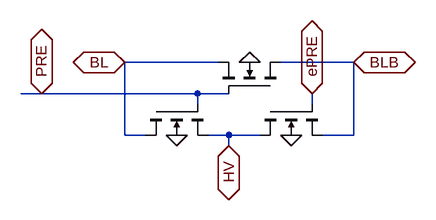
[diagram p0: schematic equalizer.asc]
equalizer.asc, the LTspice schematic file:
Version 4
SHEET 1 880 680
WIRE 192 96 48 96
WIRE 400 96 288 96
WIRE -80 144 -112 144
WIRE 160 144 -80 144
WIRE 208 144 160 144
WIRE 160 160 160 144
WIRE 336 160 336 144
WIRE 48 208 48 96
WIRE 80 208 48 208
WIRE 208 208 176 208
WIRE 256 208 208 208
WIRE 400 208 400 96
WIRE 400 208 352 208
WIRE 208 224 208 208
FLAG 240 96 0
FLAG 128 208 0
FLAG 304 208 0
FLAG -80 144 PRE
IOPIN -80 144 BiDir
FLAG 48 96 BL
IOPIN 48 96 BiDir
FLAG 400 96 BLB
IOPIN 400 96 BiDir
FLAG 208 224 HV
IOPIN 208 224 BiDir
FLAG 336 144 ePRE
IOPIN 336 144 BiDir
SYMBOL nmos4 288 144 M270
WINDOW 0 104 24 Invisible 2
WINDOW 3 179 41 Invisible 2
SYMATTR InstName M1
SYMATTR Value2 l={mc(SA_eq_L,mc_variation)} w={mc(SA_eq_W, mc_variation)}
SYMBOL nmos4 80 160 M90
WINDOW 0 104 24 Invisible 2
WINDOW 3 179 41 Invisible 2
SYMATTR InstName M2
SYMATTR Value2 l={mc(SA_eq_L_half,mc_variation)} w={mc(SA_eq_W_half,mc_variation)}
SYMBOL nmos4 256 160 M90
WINDOW 0 104 24 Invisible 2
WINDOW 3 179 41 Invisible 2
SYMATTR InstName M3
SYMATTR Value2 l={mc(SA_eq_L_half,mc_variation)} w={mc(SA_eq_W_half,mc_variation)}

The netlist it stands for:
* equalizer.asc
M1 BLB PRE BL 0 NMOS l={mc(SA_eq_L,mc_variation)} w={mc(SA_eq_W, mc_variation)}
M2 BL PRE HV 0 NMOS l={mc(SA_eq_L_half,mc_variation)} w={mc(SA_eq_W_half,mc_variation)}
M3 HV ePRE BLB 0 NMOS l={mc(SA_eq_L_half,mc_variation)} w={mc(SA_eq_W_half,mc_variation)}
.model NMOS NMOS
.model PMOS PMOS
.lib standard.mos
.backanno
.end